# Altium schematic sheet esp_rot.SchDoc: ESP8266 Alarm
size A4; Author: MR; DrawnBy: MR; Revision: 0.1; SheetNumber: 1; SheetTotal: 1
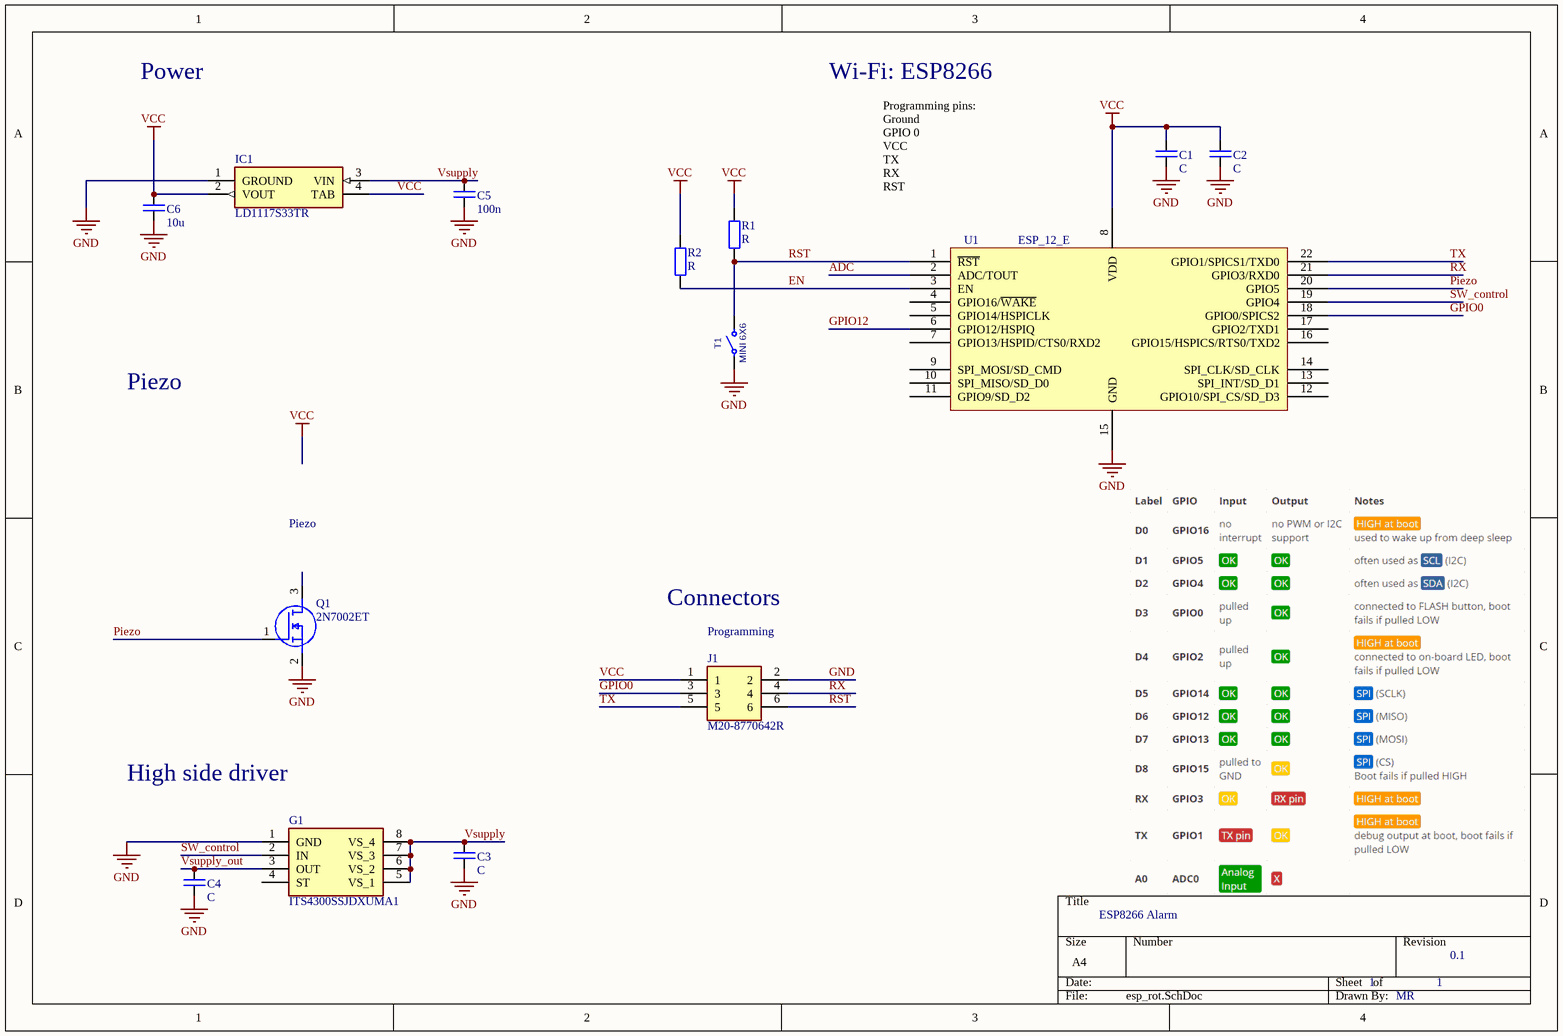
[diagram p0: esp_rot.SchDoc]

## Parts
C1  C  [C3216_1206I_M]
C2  C  [C3216_1206I_M]
C3  C  [C3216_1206I_M]
C4  C  [C3216_1206I_M]
C5  100n  [C3216_1206I_M]
C6  10u  [C3216_1206I_M]
G1  ITS4300SSJDXUMA1  [SOIC127P600X175-8N]
IC1  LD1117S33TR  [SOT230P700X180-4N]
J1  M20-8770642R  [M208770642R]
Q1  2N7002ET  [SOT95P237X101-3N]
R1  R  [R2012_0805I_M]
R2  R  [R2012_0805I_M]
T1  MINI 6X6  [SW 5x6 SMD SHORT]
U1  ESP_12_E  [ESP_12_E]

## Nets
GND: C1.2 C2.2 C3.2 C4.2 C5.2 C6.2 G1.1(GND) IC1.1(GROUND) J1.2 Q1.2(S) T1.1 U1.15(GND)
VCC: C1.1 C2.1 C6.1 IC1.2(VOUT) IC1.4(TAB) J1.1 R1.1 R2.1 U1.8(VDD)
ADC: U1.2(ADC/TOUT)
EN: R2.2 U1.3(EN)
GPIO0: J1.3 U1.18(GPIO0/SPICS2)
GPIO12: U1.6(GPIO12/HSPIQ)
Piezo: Q1.1(G) U1.20(GPIO5)
RST: J1.6 R1.2 T1.2 U1.1(~{RST})
RX: J1.4 U1.21(GPIO3/RXD0)
SW_control: G1.2(IN) U1.19(GPIO4)
TX: J1.5 U1.22(GPIO1/SPICS1/TXD0)
Vsupply: C3.1 C5.1 G1.5(VS_1) G1.6(VS_2) G1.7(VS_3) G1.8(VS_4) IC1.3(VIN)
Vsupply_out: C4.1 G1.3(OUT)

Not connected (* = marked no-connect by the designer): G1 4(ST); Q1 3(D); U1 4(GPIO16/~{WAKE}) 5(GPIO14/HSPICLK) 7(GPIO13/HSPID/CTS0/RXD2) 9(SPI_MOSI/SD_CMD) 10(SPI_MISO/SD_D0) 11(GPIO9/SD_D2) 12(GPIO10/SPI_CS/SD_D3) 13(SPI_INT/SD_D1) 14(SPI_CLK/SD_CLK) 16(GPIO15/HSPICS/RTS0/TXD2) 17(GPIO2/TXD1)

## Notes on the sheet
- Power
- Wi-Fi: ESP8266
- Programming pins:
  Ground
  GPIO 0
  VCC
  TX
  RX
  RST
- Piezo
- Connectors
- (near J1) Programming
- High side driver

## Library data of the parts
C1-C6 = C: Capacitor
G1 = ITS4300SSJDXUMA1: Generator or Oscillator; Manufacturer_Name: Infineon; Datasheet Link: https://www.infineon.com/dgdl/Infineon-ITS4300S_SJ_D_01092012S-DS-v01_00-en.pdf?fileId=db3a304339dcf4b1013a01424bef5743; Height: 1.75mm; Manufacturer_Part_Number: ITS4300SSJDXUMA1; Mouser Part Number: 726-ITS4300SSJDXUMA1; Mouser Price/Stock: https://www.mouser.com/Search/Refine.aspx?Keyword=726-ITS4300SSJDXUMA1; RS Part Number: 1660787; RS Price/Stock: https://uk.rs-online.com/web/p/products/1660787
IC1 = LD1117S33TR: Integrated Circuit; Manufacturer_Name: STMicroelectronics; Allied_Number: 70390201; Datasheet Link: http://www.st.com/st-web-ui/static/active/en/resource/technical/document/datasheet/CD00000544.pdf; Height: 1.8mm; Manufacturer_Part_Number: LD1117S33TR; Mouser Part Number: 511-LD1117S33; Mouser Price/Stock: https://www.mouser.com/Search/Refine.aspx?Keyword=511-LD1117S33; RS Part Number: 7140697P; RS Price/Stock: http://uk.rs-online.com/web/p/products/7140697P; Allied Price/Stock: http://www.alliedelec.com/stmicroelectronics-ld1117s33tr/70390201/
J1 = M20-8770642R: Connector; Manufacturer_Name: HARWIN; Datasheet Link: https://cdn.harwin.com/pdfs/M20-877R.pdf; Height: 8mm; Manufacturer_Part_Number: M20-8770642R; Mouser Part Number: 855-M20-8770642R; Mouser Price/Stock: https://www.mouser.com/Search/Refine.aspx?Keyword=855-M20-8770642R
Q1 = 2N7002ET: MOSFET (N-Channel); Manufacturer_Name: ON Semiconductor; Datasheet Link: http://www.onsemi.com/pub/Collateral/2N7002E-D.PDF; Height: 1.01mm; Manufacturer_Part_Number: 2N7002ET; RS Part Number: 6900127; RS Price/Stock: http://uk.rs-online.com/web/p/products/6900127
T1 = MINI 6X6: pin to pad: 1>1+4 2>2+3; Value: *
U1 = ESP_12_E: ESP-12 Wi-Fi Module by AI-Thinker; IC: ESP8266-EX; Vendor: Ai-thinker